# EAGLE schematic common-collector-1 (EAGLE 7.7.0)
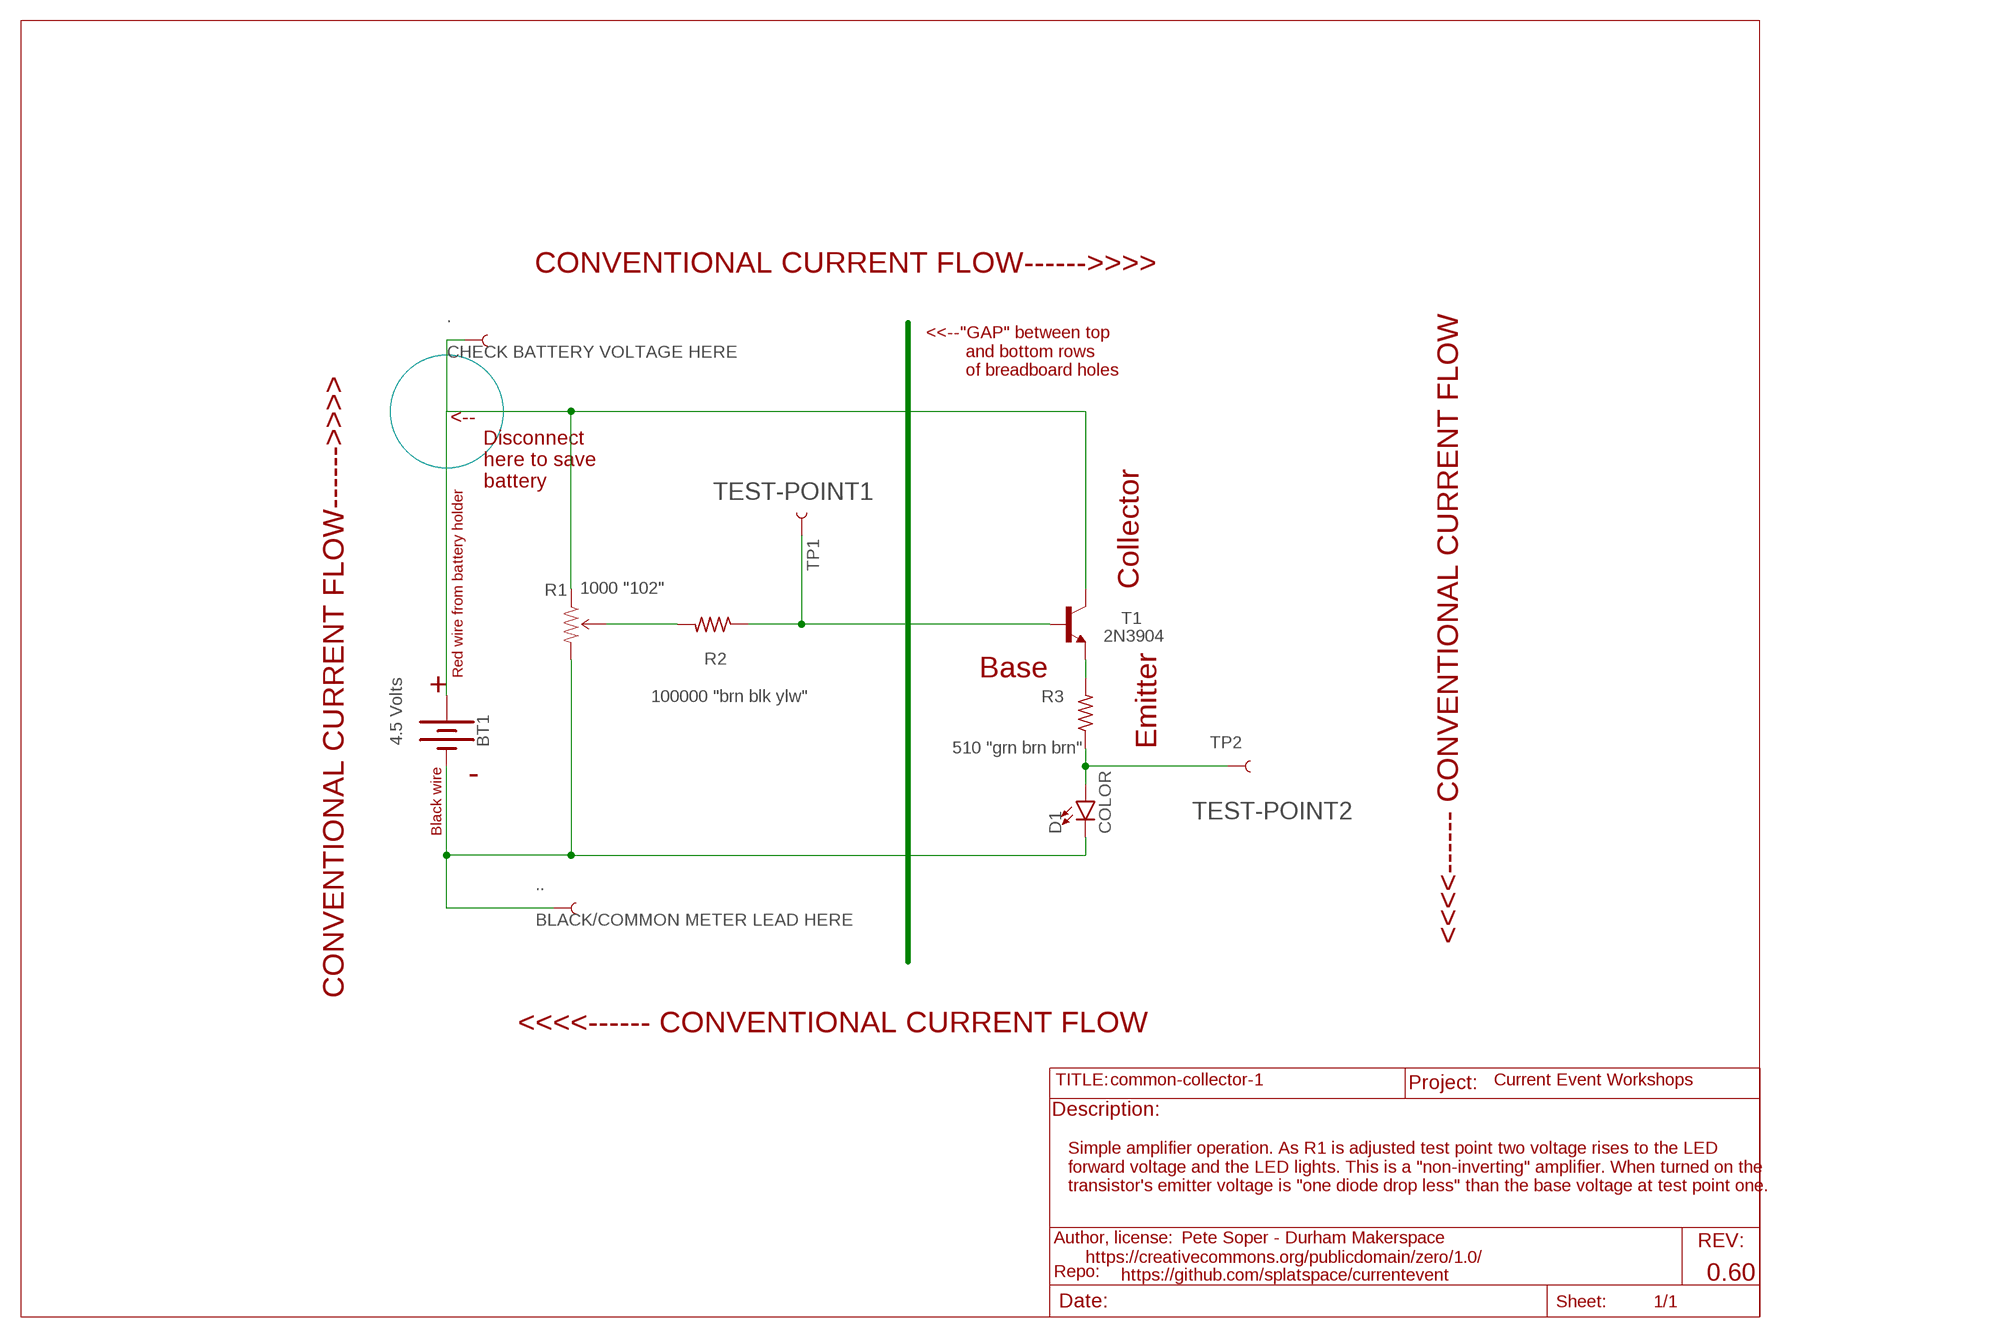
[diagram p0: schematic, sheet 1]

## Parts
.  CHECK BATTERY VOLTAGE HERE  TEST-POINT2  [PAD.02X.02]
..  BLACK/COMMON METER LEAD HERE  TEST-POINT2  [PAD.02X.02]
BT1  4.5 Volts  BATTERY-AAA_KIT  [BATTERY-AAA-KIT]
D1  COLOR  LED5MM  [LED_5MM]
R1  1000 "102"  TRIMPOT3362U-2  [3362U-2]
R2  100000 "brn blk ylw"  R-US_0309/12  [0309/12]
R3  510 "grn brn brn"  R-US_0309/12  [0309/12]
T1  2N3904  [TO92]
TP1  TEST-POINT1  TEST-POINT2  [PAD.02X.02]
TP2  TEST-POINT2  [PAD.02X.02]

## Nets
N$1: R3.2 T1.3(E)
N$2: R1.2(WIPER) R2.2
N$3: R2.1 T1.2(B) TP1.P$1
N$4: ..P$1 R1.1(CCW) T1.1(C)
N$5: ...P$1 BT1.GND@1(-) D1.K(C) R1.3(CW)
N$7: BT1.PWR@1(+)
N$8: D1.A R3.1 TP2.P$1

## Notes on the sheet
- CONVENTIONAL CURRENT FLOW------>>>>
- CONVENTIONAL CURRENT FLOW------>>>>
- <<--"GAP" between top
          and bottom rows
          of breadboard holes
- <--
        Disconnect
        here to save
        battery
- Collector
- Red wire from battery holder | Base
- +
- Emitter
- -
- Black wire
- <<<<------ CONVENTIONAL CURRENT FLOW
- <<<<------ CONVENTIONAL CURRENT FLOW
- Current Event Workshops
- Simple amplifier operation. As R1 is adjusted test point two voltage rises to the LED
  forward voltage and the LED lights. This is a "non-inverting" amplifier. When turned on the
  transistor's emitter voltage is "one diode drop less" than the base voltage at test point one.
- Pete Soper - Durham Makerspace
- https://creativecommons.org/publicdomain/zero/1.0/
- https://github.com/splatspace/currentevent | 0.60

## Library data of the parts
. .. TP1 TP2 = SparkFun-Connectors:TEST-POINT: SparkFun Test Points Bare copper test points for troubleshooting or In-Circuit-Testing. These are used by our Production team for verifying production board runs using pogo-pins on test beds. SparkFun Products: SparkFun LSM9DS1 Breakout <https://www.sparkfun.com/products/13284> SparkFun PSOC <https://www.sparkfun.com/products/13714> SparkFun Load Cell Amplifier <https://www.sparkfun.com/products/13879>
BT1 = SparkFun-Batteries:BATTERY: Battery - Single Cell A variety of battery chemistries, sizes, and footprints. Device List: 20MM_PTH - Coin Cell Battery Holder - 20mm (PTH) <https://www.sparkfun.com/products/783> 12MM_SMD - Coin Cell Battery Holder - 12mm (SMD) <https://www.sparkfun.com/products/10592> 12MM_PTH - Coin Cell Battery Holder - 12mm (PTH) <https://www.sparkfun.com/products/7948> 20MM_SMD - 20mm Coin Cell Battery Holder (SMD) (2 legs) Used on the Big Time Watch Kit <https://www.sparkfun.com/products/11734> 20MM_SMD_4LEGS - Coin Cell Battery Holder - 20mm (SMD) <https://www.sparkfun.com/products/11892> 20MM_SMD_4LEGS_OVERPASTE - Coin Cell Battery Holder - 20mm (SMD) <https://www.sparkfun.com/products/11892> (Over-paste on the legs) 24.5MM_PTH - Coin Cell Battery Holder - 24.5mm (PTH) <https://www.sparkfun.com/products/8863> 9V - 9V Battery Holder - PC Mount Used on the SparkFun SparkPunk Sound Kit <https://www.sparkfun.com/products/11177> and SparkFun SparkPunk Sequencer Kit <https://www.sparkfun.com/products/12707> 18650 - Battery Holder - 18650 (PTH) <https://www.sparkfun.com/products/13113> AA - Battery Holder - 1xAA (PTH) <https://www.sparkfun.com/products/7949> AAA - Battery Holder - 1xAAA (PTH) <https://www.sparkfun.com/products/12718> AA_KIT - Battery Holder - 1xAA (PTH) <https://www.sparkfun.com/products/7949> Special kit package - pads only have exposed copper on one side of the board. AAA_KIT - Battery Holder - 1xAAA (PTH) <https://www.sparkfun.com/products/12718> Special kit package - pads only have exposed copper on one side of the board.; PROD_ID: BATT-08571; SF_SKU: PRT-12718
D1 = SparkFun-LED:LED: LED (Generic) Standard schematic elements and footprints for 5mm, 3mm, 1206, and 0603 sized LEDs. Generic LEDs with no color specified.
R1 = SparkFun-Retired:TRIMPOT: Various small potentiometers for "set-and-forget" applications; PROD_ID: RES-08876
R2 R3 = rcl:R-US_: RESISTOR, American symbol
T1 = transistor:2N3904: NPN TRANSISTOR